# EAGLE design 130812_AriloTX_FINAL (EAGLE 6.4)
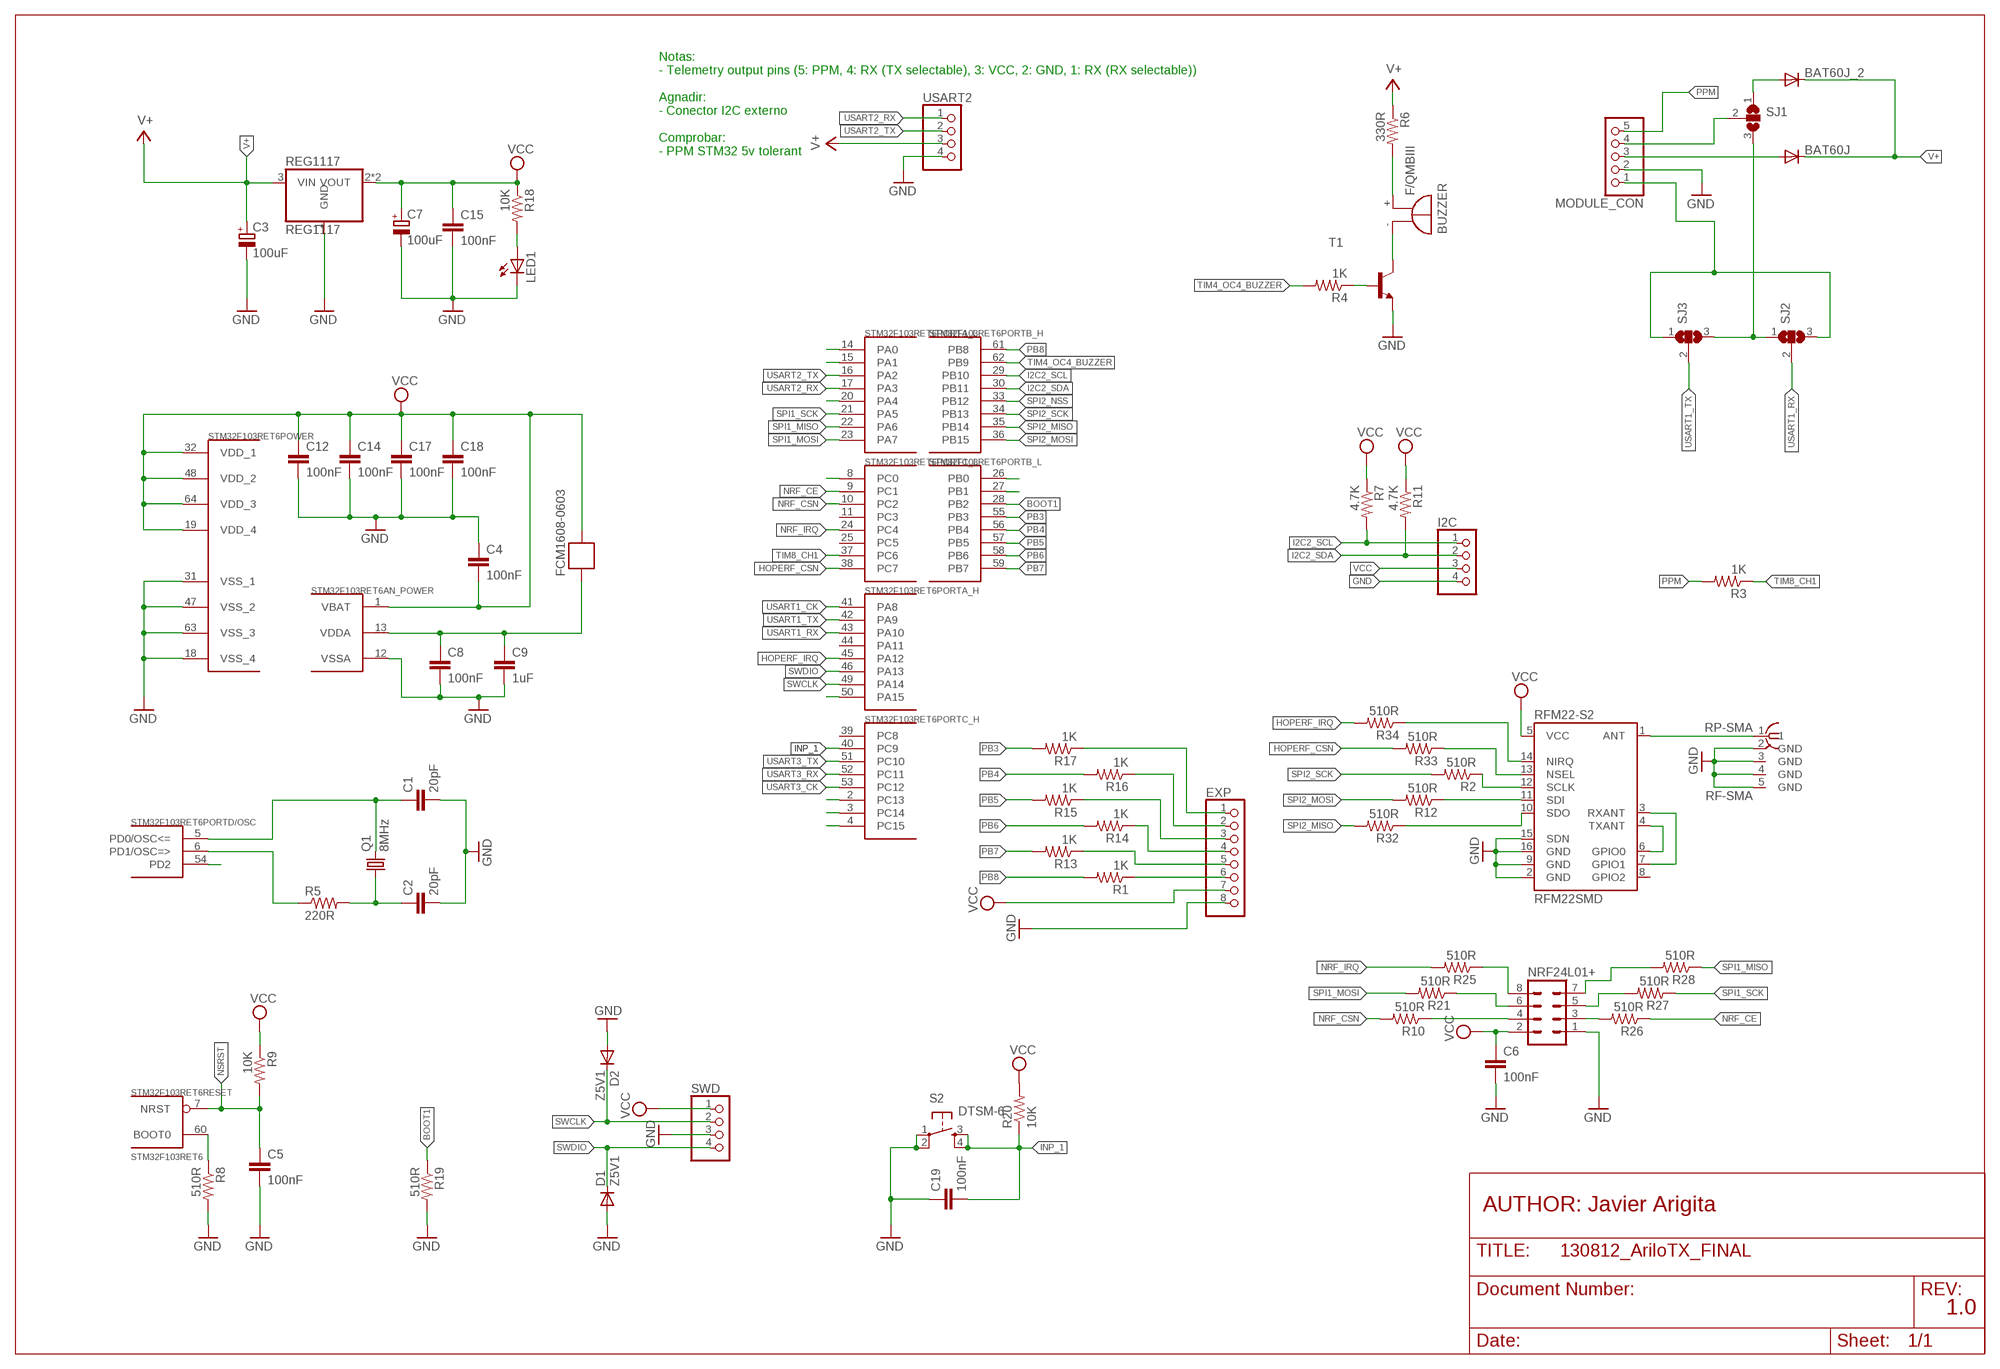
[diagram p0: schematic, sheet 1]

## Parts
BAT60J  DIODE-SOD323-R  [SOD323-R]
BAT60J_2  DIODE-SOD323-R  [SOD323-R]
BUZZER  F/QMBIII  [F/QMBIII]
C1  20pF  C-EUC0805  [C0805]
C2  20pF  C-EUC0805  [C0805]
C3  100uF  CPOL-EUSMCB  [SMC_B]
C4  100nF  C-EUC0805  [C0805]
C5  100nF  C-EUC0805  [C0805]
C6  100nF  C-EUC0805  [C0805]
C7  100uF  CPOL-EUSMCB  [SMC_B]
C8  100nF  C-EUC0805  [C0805]
C9  1uF  C-EUC3216  [C3216]
C12  100nF  C-EUC0805  [C0805]
C14  100nF  C-EUC0805  [C0805]
C15  100nF  C-EUC0805  [C0805]
C17  100nF  C-EUC0805  [C0805]
C18  100nF  C-EUC0805  [C0805]
C19  100nF  C-EUC0805  [C0805]
D1  Z5V1  DIODE-SOD323-R  [SOD323-R]
D2  Z5V1  DIODE-SOD323-R  [SOD323-R]
EXP  PINHD-1X8  [1X08]
FCM1608-0603  FERRITE-BEAD  [R0603]
I2C  PINHD-1X4  [1X04]
LED1  LED0805  [CHIPLED_0805]
MODULE_CON  PINHD-1X5  [1X05]
NRF24L01+  MA04-2  [MA04-2]
Q1  8MHz  CRYSTALSM49  [SM49]
R1  1K  RESISTOR0805  [R0805]
R2  510R  RESISTOR0805  [R0805]
R3  1K  RESISTOR0805  [R0805]
R4  1K  RESISTOR0805  [R0805]
R5  220R  RESISTOR0805  [R0805]
R6  330R  RESISTOR0805  [R0805]
R7  4.7K  RESISTOR0805  [R0805]
R8  510R  RESISTOR0805  [R0805]
R9  10K  RESISTOR0805  [R0805]
R10  510R  RESISTOR0805  [R0805]
R11  4.7K  RESISTOR0805  [R0805]
R12  510R  RESISTOR0805  [R0805]
R13  1K  RESISTOR0805  [R0805]
R14  1K  RESISTOR0805  [R0805]
R15  1K  RESISTOR0805  [R0805]
R16  1K  RESISTOR0805  [R0805]
R17  1K  RESISTOR0805  [R0805]
R18  10K  RESISTOR0805  [R0805]
R19  510R  RESISTOR0805  [R0805]
R20  10K  RESISTOR0805  [R0805]
R21  510R  RESISTOR0805  [R0805]
R25  510R  RESISTOR0805  [R0805]
R26  510R  RESISTOR0805  [R0805]
R27  510R  RESISTOR0805  [R0805]
R28  510R  RESISTOR0805  [R0805]
R32  510R  RESISTOR0805  [R0805]
R33  510R  RESISTOR0805  [R0805]
R34  510R  RESISTOR0805  [R0805]
REG1117  REG1117  [SOT223]
RFM22-S2  RFM22SMD  [RFM22-XXX-S2]
RP-SMA  RF-SMA  [BU-SMA-H]
S2  DTSM-6  [DTSM-6]
SJ1  SJ2W  [SJ_2]
SJ2  SJ2W  [SJ_2]
SJ3  SJ2W  [SJ_2]
STM32F103RET6  STM32F103RET6  STM32F10XRXT6  [TQFP64]
SWD  PINHD-1X4  [1X04]
T1  BC848-NPN-SOT23-BEC  [SOT23-BEC]
USART2  PINHD-1X4  [1X04]

## Nets
BOOT1: R19.1 STM32F103RET6.28(PORTB_L:PB2)
GND: C1.2 C2.2 C3.- C4.1 C5.2 C6.2 C7.- C8.2 C9.2 C12.2 C14.2 C15.2 C17.2 C18.2 C19.1 D1.A D2.A EXP.8 I2C.4 LED1.C MODULE_CON.2 NRF24L01+.1 R8.2 R19.2 REG1117.1(GND) RFM22-S2.2(GND) RFM22-S2.9(GND) RFM22-S2.15(SDN) RFM22-S2.16(GND) RP-SMA.2(GND) RP-SMA.3(GND) RP-SMA.4(GND) RP-SMA.5(GND) S2.1 S2.2 STM32F103RET6.12(AN_POWER:VSSA) STM32F103RET6.18(POWER:VSS_4) STM32F103RET6.31(POWER:VSS_1) STM32F103RET6.47(POWER:VSS_2) STM32F103RET6.63(POWER:VSS_3) SWD.3 T1.E USART2.4
HOPERF_CSN: R33.2 STM32F103RET6.38(PORTC_L:PC7)
HOPERF_IRQ: R34.2 STM32F103RET6.45(PORTA_H:PA12)
I2C2_SCL: I2C.1 R7.2 STM32F103RET6.29(PORTB_H:PB10)
I2C2_SDA: I2C.2 R11.2 STM32F103RET6.30(PORTB_H:PB11)
INP_1: C19.2 R20.1 S2.3 S2.4 STM32F103RET6.40(PORTC_H:PC9)
N$1: C1.1 Q1.2 STM32F103RET6.5(PORTD/OSC:PD0/OSC<=)
N$2: R5.1 STM32F103RET6.6(PORTD/OSC:PD1/OSC=>)
N$3: C2.1 Q1.1 R5.2
N$4: R8.1 STM32F103RET6.60(RESET:BOOT0)
N$5: RFM22-S2.3(RXANT) RFM22-S2.7(GPIO1)
N$6: RFM22-S2.4(TXANT) RFM22-S2.6(GPIO0)
N$7: R2.1 RFM22-S2.12(SCLK)
N$8: R12.1 RFM22-S2.11(SDI)
N$9: MODULE_CON.4 SJ1.2
N$10: LED1.A R18.2
N$11: BAT60J_2.A SJ1.1
N$12: R32.1 RFM22-S2.10(SDO)
N$13: SJ1.3 SJ2.1 SJ3.3
N$14: BAT60J.A MODULE_CON.3
N$15: MODULE_CON.1 SJ2.3 SJ3.1
N$16: BUZZER.+(-) R6.2
N$17: C8.1 C9.1 FCM1608-0603.2 STM32F103RET6.13(AN_POWER:VDDA)
N$18: NRF24L01+.4 R10.1
N$19: NRF24L01+.3 R26.2
N$20: RFM22-S2.1(ANT) RP-SMA.1
N$21: R4.1 T1.B
N$22: R34.1 RFM22-S2.14(NIRQ)
N$23: BUZZER.-(+) T1.C
N$24: R33.1 RFM22-S2.13(NSEL)
N$25: STM32F103RET6.14(PORTA_L:PA0)
N$26: STM32F103RET6.15(PORTA_L:PA1)
N$27: EXP.6 R1.1
N$28: EXP.5 R13.1
N$29: STM32F103RET6.20(PORTA_L:PA4)
N$30: EXP.4 R14.1
N$31: STM32F103RET6.8(PORTC_L:PC0)
N$32: STM32F103RET6.26(PORTB_L:PB0)
N$33: STM32F103RET6.27(PORTB_L:PB1)
N$34: EXP.3 R15.1
N$35: EXP.2 R16.1
N$36: NRF24L01+.5 R27.2
N$37: EXP.1 R17.1
N$38: NRF24L01+.6 R21.1
N$39: NRF24L01+.8 R25.1
N$42: NRF24L01+.7 R28.2
N$43: STM32F103RET6.50(PORTA_H:PA15)
N$44: STM32F103RET6.2(PORTC_H:PC13)
N$45: STM32F103RET6.3(PORTC_H:PC14)
N$46: STM32F103RET6.4(PORTC_H:PC15)
N$47: STM32F103RET6.54(PORTD/OSC:PD2)
NRF_CE: R26.1 STM32F103RET6.9(PORTC_L:PC1)
NRF_CSN: R10.2 STM32F103RET6.10(PORTC_L:PC2)
NRF_IRQ: R25.2 STM32F103RET6.24(PORTC_L:PC4)
NSRST: C5.1 R9.2 STM32F103RET6.7(RESET:NRST)
PB3: R17.2 STM32F103RET6.55(PORTB_L:PB3)
PB4: R16.2 STM32F103RET6.56(PORTB_L:PB4)
PB5: R15.2 STM32F103RET6.57(PORTB_L:PB5)
PB6: R14.2 STM32F103RET6.58(PORTB_L:PB6)
PB7: R13.2 STM32F103RET6.59(PORTB_L:PB7)
PB8: R1.2 STM32F103RET6.61(PORTB_H:PB8)
PPM: MODULE_CON.5 R3.2
SPI1_MISO: R28.1 STM32F103RET6.22(PORTA_L:PA6)
SPI1_MOSI: R21.2 STM32F103RET6.23(PORTA_L:PA7)
SPI1_SCK: R27.1 STM32F103RET6.21(PORTA_L:PA5)
SPI2_MISO: R32.2 STM32F103RET6.35(PORTB_H:PB14)
SPI2_MOSI: R12.2 STM32F103RET6.36(PORTB_H:PB15)
SPI2_NSS: STM32F103RET6.33(PORTB_H:PB12)
SPI2_SCK: R2.2 STM32F103RET6.34(PORTB_H:PB13)
SWCLK: D2.C STM32F103RET6.49(PORTA_H:PA14) SWD.2
SWDIO: D1.C STM32F103RET6.46(PORTA_H:PA13) SWD.4
TIM4_OC4_BUZZER: R4.2 STM32F103RET6.62(PORTB_H:PB9)
TIM8_CH1: R3.1 STM32F103RET6.37(PORTC_L:PC6)
USART1_CK: STM32F103RET6.41(PORTA_H:PA8)
USART1_RX: SJ2.2 STM32F103RET6.43(PORTA_H:PA10)
USART1_TX: SJ3.2 STM32F103RET6.42(PORTA_H:PA9)
USART2_RX: STM32F103RET6.17(PORTA_L:PA3) USART2.1
USART2_TX: STM32F103RET6.16(PORTA_L:PA2) USART2.2
USART3_CK: STM32F103RET6.53(PORTC_H:PC12)
USART3_RX: STM32F103RET6.52(PORTC_H:PC11)
USART3_TX: STM32F103RET6.51(PORTC_H:PC10)
V+: BAT60J.C BAT60J_2.C C3.+ R6.1 REG1117.3(VIN) USART2.3
VCC: C4.2 C6.1 C7.+ C12.1 C14.1 C15.1 C17.1 C18.1 EXP.7 FCM1608-0603.1 I2C.3 NRF24L01+.2 R7.1 R9.1 R11.1 R18.1 R20.2 REG1117.2(VOUT) REG1117.4(VOUT) RFM22-S2.5(VCC) STM32F103RET6.1(AN_POWER:VBAT) STM32F103RET6.19(POWER:VDD_4) STM32F103RET6.32(POWER:VDD_1) STM32F103RET6.48(POWER:VDD_2) STM32F103RET6.64(POWER:VDD_3) SWD.1
Unconnected: RFM22-S2.8(GPIO2) STM32F103RET6.11(PORTC_L:PC3) STM32F103RET6.25(PORTC_L:PC5) STM32F103RET6.39(PORTC_H:PC8) STM32F103RET6.44(PORTA_H:PA11)

## Notes on the sheet
- Notas:
  - Telemetry output pins (5: PPM, 4: RX (TX selectable), 3: VCC, 2: GND, 1: RX (RX selectable))
  
  Agnadir:
  - Conector I2C externo
  
  Comprobar:
  - PPM STM32 5v tolerant
- AUTHOR: Javier Arigita
- 1.0

## Library data of the parts
BAT60J BAT60J_2 D1 D2 = diode:DIODE-: DIODE
BUZZER = buzzer:F/QMBIII: BUZZER Source: Buerklin; OC_FARNELL: unknown; OC_NEWARK: unknown
C1 C2 C4-C6 C8 C12 C14 C15 C17-C19 = rcl:C-EU: CAPACITOR, European symbol
C3 C7 = rcl:CPOL-EU: POLARIZED CAPACITOR, European symbol
C9 = resistor:C-EU: CAPACITOR, European symbol
EXP = pinhead:PINHD-1X8: PIN HEADER
FCM1608-0603 = BaseApp:FERRITE-BEAD
I2C SWD USART2 = pinhead:PINHD-1X4: PIN HEADER
LED1 = CEDT:LED
MODULE_CON = pinhead:PINHD-1X5: PIN HEADER
NRF24L01+ = con-lstb:MA04-2: PIN HEADER; OC_FARNELL: unknown; OC_NEWARK: unknown
Q1 = crystal:CRYSTAL: CRYSTAL; OC_FARNELL: unknown; OC_NEWARK: unknown
R1-R21 R25-R28 R32-R34 = CEDT:RESISTOR
REG1117 = CEDT:REG1117: 800mA and 1A Low Dropout (LDO) Positive Regulator 1.8V, 2.5V, 2.85V, 3.3V, 5V, and Adj
RFM22-S2 = SparkFun-RF:RFM22: The RFM22 is a low-power, low cost radio that is capable of operating in the 434MHz and 900MHz open bands. It's frequency is software defined and there are some very good libraries written for it.
RP-SMA = BaseApp:RF-SMA
S2 = switch-tact:DTSM-6
SJ1-SJ3 = jumper:SJ2W: SMD solder JUMPER
STM32F103RET6 = stm32:STM32F10XRXT6: STM32F101/103 64pin LQFP
T1 = transistor:*-NPN-: NPN Transistror BF959 corrected 2008.03.06

## Board
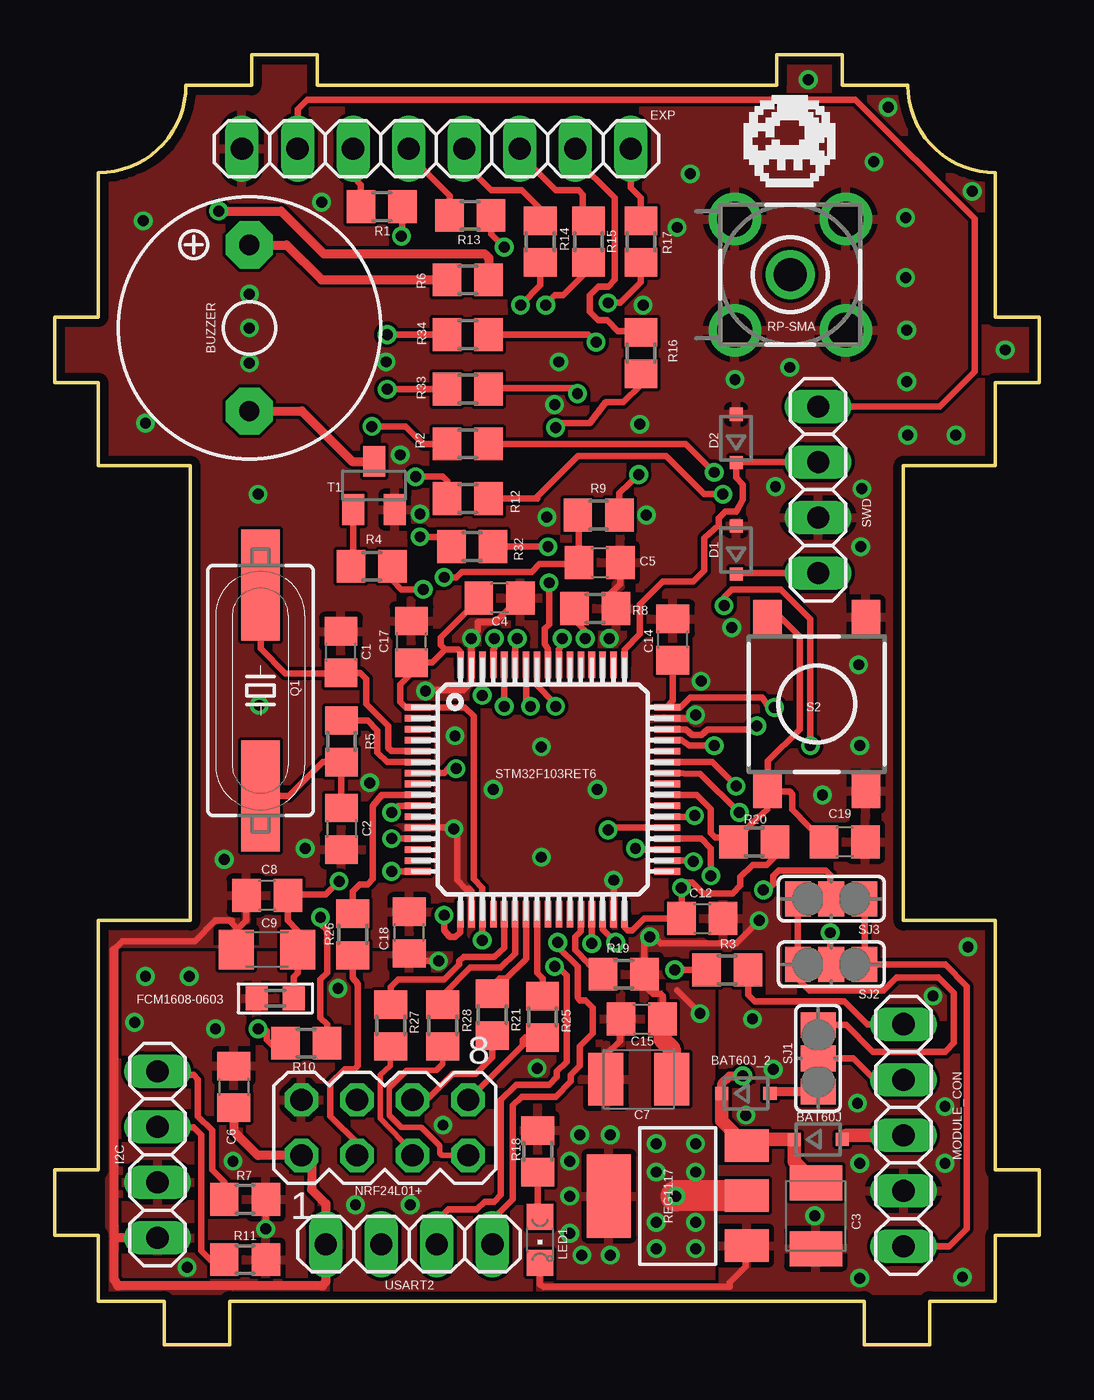
[diagram p1: board, top side]
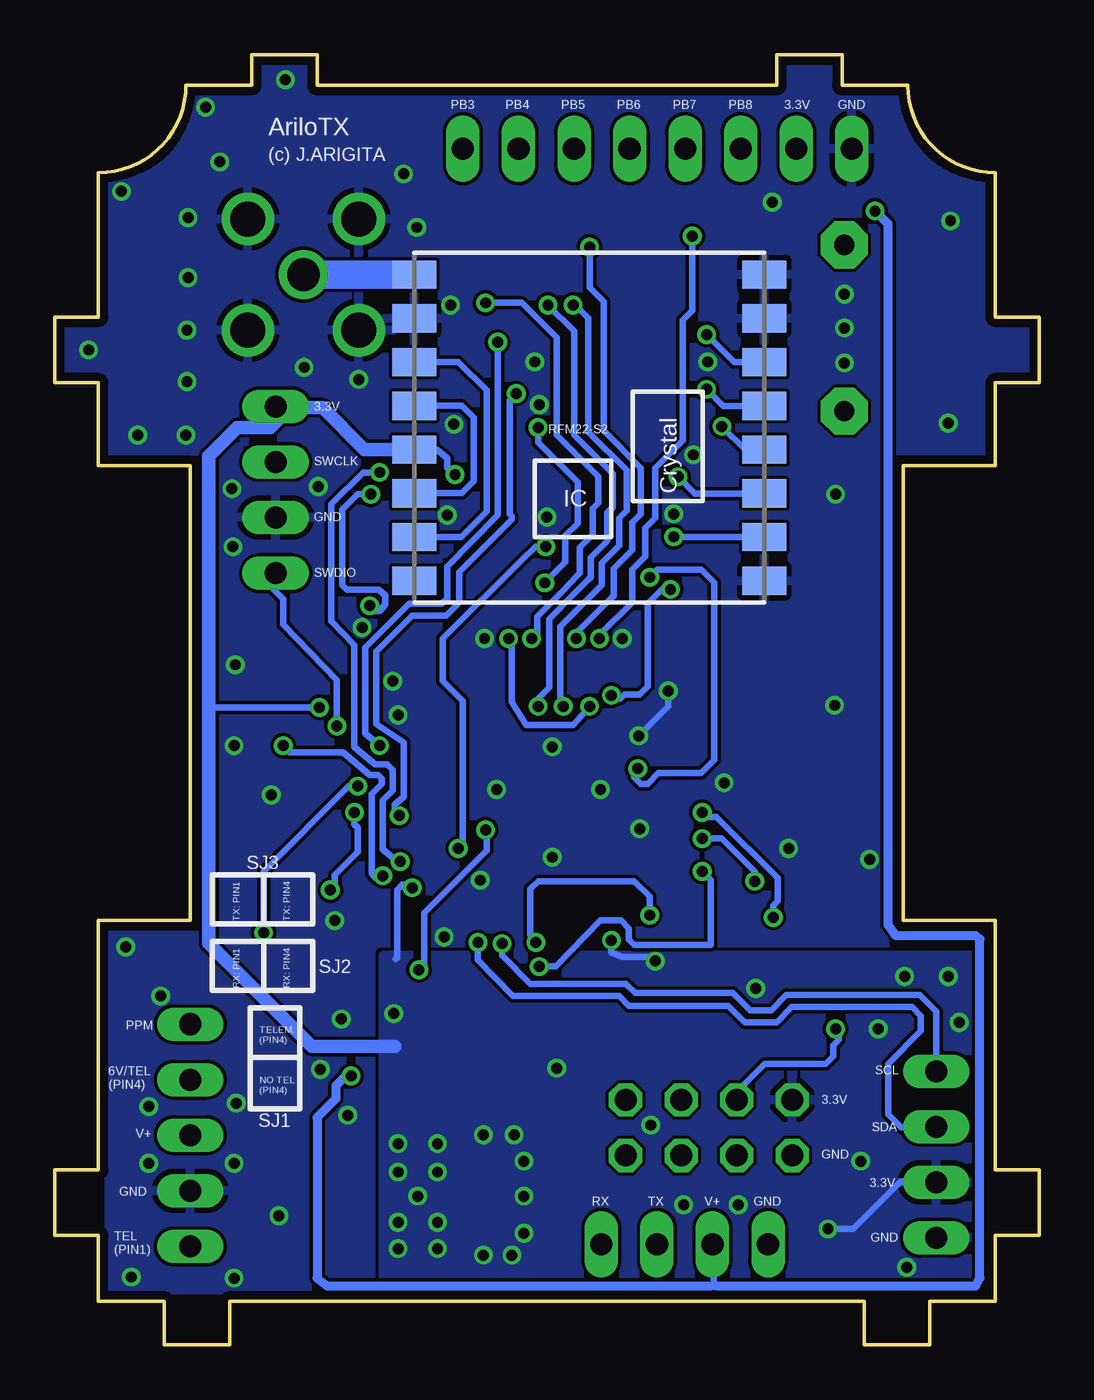
[diagram p2: board, bottom side, seen from below]

Size 45 x 59 mm. Coordinates in mm from the lower left corner, seen from the top.
Outline: 2,2 5,2 5,0 8,0 8,2 37,2 37,0 40,0 40,2 43,2 43,5 45,5 45,8 43,8 43,19.4 38.8,19.4 38.8,40.2 43,40.2 43,44 45,44 45,47 43,47 43,53.6 arc-90 39,57.6 36,57.6 36,59 33,59 33,57.6 12,57.6 12,59 9,59 9,57.6 6,57.6 arc-90 2,53.6 2,47 0,47 0,44 2,44 2,40.2 6.2,40.2 6.2,19.4 2,19.4 2,8 0,8 0,5 2,5 2,2
Copper layers (1*16): Top 0.0356mm / dielectric 1.5011mm / Bottom 0.0356mm
Design rules: minimum track width 6mil, minimum drill 13mil, track to track 6mil, track to pad 6mil, pad to pad 6mil, via to via 6mil, smd to smd 6mil, copper to edge 15mil, drill to drill 6mil, minimum pad ring 7mil, minimum via ring 7mil, stop-mask expansion 4mil, vias tented up to drill 0mil, thermal gap 10mil

### Footprints (pad centres in the part's own frame; a part is rotated, then mirrored left to right if it is on the bottom)
SOD323-R = smd 0.6 x 0.6: A 1.1,0; C -1.1,0
F/QMBIII = drill 0.914 pad 2.159 octagon: + 3.8,0; - -3.8,0
C0805 = smd 1.3 x 1.5: 1 -0.95,0; 2 0.95,0
SMC_B = smd 1.6 x 2.4: + -1.5,0; - 1.5,0
C3216 = smd 1.6 x 1.8: 1 -1.4,0; 2 1.4,0
1X08 = drill 1.016 long: 1 -8.89,0; 2 -6.35,0; 3 -3.81,0; 4 -1.27,0; 5 1.27,0; 6 3.81,0; 7 6.35,0; 8 8.89,0
R0603 = smd 1 x 1.1: 1 -0.85,0; 2 0.85,0
1X04 = drill 1.016 long: 1 -3.81,0; 2 -1.27,0; 3 1.27,0; 4 3.81,0
CHIPLED_0805 = smd 1.2 x 1.2: A 0,-1.05; C 0,1.05
1X05 = drill 1.016 long: 1 -5.08,0; 2 -2.54,0; 3 0,0; 4 2.54,0; 5 5.08,0
MA04-2 = drill 1.016 octagon: 1 -3.81,-1.27; 2 -3.81,1.27; 3 -1.27,-1.27; 4 -1.27,1.27; 5 1.27,-1.27; 6 1.27,1.27; 7 3.81,-1.27; 8 3.81,1.27
SM49 = smd 5.08 x 1.778: 1 -4.826,0; 2 4.826,0
R0805 = smd 1.3 x 1.5: 1 -0.95,0; 2 0.95,0
SOT223 = smd 1.499 x 2.007: 1 -2.261,-3.15; 2 0.025,-3.15; 3 2.311,-3.15 | smd 3.81 x 2.007: 4 0,3.15
RFM22-XXX-S2 = smd 2 x 1.3: 1 -8,7; 2 -8,5; 3 -8,3; 4 -8,1; 5 -8,-1; 6 -8,-3; 7 -8,-5; 8 -8,-7; 9 8,-7; 10 8,-5; 11 8,-3; 12 8,-1; 13 8,1; 14 8,3; 15 8,5; 16 8,7
BU-SMA-H = drill 1.5: 1 0,0 | drill 1.6: 2 -2.54,2.54; 3 2.54,2.54; 4 2.54,-2.54; 5 -2.54,-2.54
DTSM-6 = smd 1.55 x 1.3: 1 -3.975,2.25; 2 3.975,2.25; 3 -3.975,-2.25; 4 3.975,-2.25
SJ_2 = smd 1.168 x 1.6: 1 -1.524,0; 2 0,0; 3 1.524,0
TQFP64 = smd 1.2 x 0.3: 1 -5.7,3.75; 2 -5.7,3.25; 3 -5.7,2.75; 4 -5.7,2.25; 5 -5.7,1.75; 6 -5.7,1.25; 7 -5.7,0.75; 8 -5.7,0.25; 9 -5.7,-0.25; 10 -5.7,-0.75; 11 -5.7,-1.25; 12 -5.7,-1.75; 13 -5.7,-2.25; 14 -5.7,-2.75; 15 -5.7,-3.25; 16 -5.7,-3.75; 33 5.7,-3.75; 34 5.7,-3.25; 35 5.7,-2.75; 36 5.7,-2.25; 37 5.7,-1.75; 38 5.7,-1.25; 39 5.7,-0.75; 40 5.7,-0.25; 41 5.7,0.25; 42 5.7,0.75; 43 5.7,1.25; 44 5.7,1.75; 45 5.7,2.25; 46 5.7,2.75; 47 5.7,3.25; 48 5.7,3.75 | smd 0.3 x 1.2: 17 -3.75,-5.7; 18 -3.25,-5.7; 19 -2.75,-5.7; 20 -2.25,-5.7; 21 -1.75,-5.7; 22 -1.25,-5.7; 23 -0.75,-5.7; 24 -0.25,-5.7; 25 0.25,-5.7; 26 0.75,-5.7; 27 1.25,-5.7; 28 1.75,-5.7; 29 2.25,-5.7; 30 2.75,-5.7; 31 3.25,-5.7; 32 3.75,-5.7; 49 3.75,5.7; 50 3.25,5.7; 51 2.75,5.7; 52 2.25,5.7; 53 1.75,5.7; 54 1.25,5.7; 55 0.75,5.7; 56 0.25,5.7; 57 -0.25,5.7; 58 -0.75,5.7; 59 -1.25,5.7; 60 -1.75,5.7; 61 -2.25,5.7; 62 -2.75,5.7; 63 -3.25,5.7; 64 -3.75,5.7
SOT23-BEC = smd 1 x 1.4: B -0.95,-1.1; C 0,1.1; E 0.95,-1.1

### Placement (x,y rotation side)
BAT60J  34.9,9.4 0 top
BAT60J_2  31.6,11.5 0 top
BUZZER  8.9,46.5 90 top
C1  13.09,31.68 90 top
C2  13.11,23.6 270 top
C3  34.8,5.9 270 top
C4  20.34,34.15 180 top
C5  24.91,35.77 0 top
C6  8.18,11.8 270 top
C7  26.7,12.15 0 top
C8  9.71,20.55 180 top
C9  9.71,18.07 180 top
C12  29.61,19.5 0 top
C14  28.26,32.25 90 top
C15  26.84,14.9 0 top
C17  16.31,32.15 90 top
C18  16.21,18.85 90 top
C19  36.11,23 180 top
D1  31.15,36.34 90 top
D2  31.15,41.45 90 top
EXP  17.45,54.7 180 top
FCM1608-0603  10.09,15.85 0 top
I2C  4.7,8.7 270 top
LED1  22.18,4.8 180 top
MODULE_CON  38.81,9.58 90 top
NRF24L01+  15.09,9.93 0 top
Q1  9.41,29.93 90 top
R1  14.95,52.05 0 top
R2  18.89,41.2 0 top
R3  30.75,17.15 0 top
R4  14.5,35.6 0 top
R5  13.11,27.6 270 top
R6  18.89,48.7 180 top
R7  8.7,6.65 180 top
R8  24.71,33.67 0 top
R9  24.86,37.95 180 top
R10  11.5,13.8 0 top
R11  8.7,3.9 180 top
R12  18.89,38.7 0 top
R13  19,51.65 0 top
R14  22.2,50.45 270 top
R15  24.4,50.45 270 top
R16  26.8,45.35 270 top
R17  26.8,50.45 270 top
R18  22.09,8.85 270 top
R19  26.01,16.95 0 top
R20  31.98,23 0 top
R21  20,15.1 90 top
R25  22.3,15 90 top
R26  13.62,18.76 270 top
R27  15.36,14.6 270 top
R28  17.73,14.6 270 top
R32  19.09,36.5 0 top
R33  18.89,43.7 0 top
R34  18.89,46.2 0 top
REG1117  28.48,6.8 90 top
RFM22-S2  20.57,41.94 0 bottom
RP-SMA  33.63,48.94 180 top
S2  34.84,29.3 270 top
SJ1  34.9,13.1 90 top
SJ2  35.5,17.4 0 top
SJ3  35.5,20.4 180 top
STM32F103RET6  22.3,25.4 0 top
SWD  34.9,39.1 270 top
T1  14.6,39.3 0 top
USART2  16.2,4.6 180 top

### Tracks (layer width: path | path; a pad name or v marks a point on that pad's centre or on a via)
BOOT1
  Top 0.305: R19.1 24.4,17.45 23.8,18.05 23.8,18.65 24.05,18.9 STM32F103RET6.28
GND  (via drill 0.5)
  Top 0.305: C8.2 8.75,20.39 8.75,19.4 8.31,18.96 C9.2 8.31,19.09 8.1,19.3 8.1,19.4 7.35,19.4 6.4,18.45 3.1,18.45 2.7,18.05 | STM32F103RET6.18 19.05,20.75 18.95,20.85 18.8,20.85 18.4,21.25 18.4,23.45 v18.25,23.6 | STM32F103RET6.47 29.15,28.65 v29.3,28.8 | 8.2,10.84 C6.2 | C15.2 27.8,14.96 27.8,15.95 27.7,16.05 27.35,16.05 26.96,16.44 R19.2 26.96,18.39 27.3,18.65 27.4,18.65 27.7,18.35 31.15,18.35 v32.2,19.4 | LED1.C 22.18,2.77 22.35,2.65 30.85,2.65 30.85,2.85 31.6,3.6 31.6,4.5 REG1117.1 | STM32F103RET6.31 25.55,21.2 | v19.05,32.3 STM32F103RET6.63 19.05,30.3 18.7,29.95 17.15,29.95 v16.95,29.9 | R8.2 25.31,34.26 25.85,34.8 25.85,35.8 25.86,35.79 C5.2 | C4.1 21.04,33.94 20.15,33.05 19.35,33.05 19.35,32.65 19.05,32.35 | STM32F103RET6.12 18.25,23.65 | 2.7,4.98 2.79,4.89
  Top 0.406: I2C.4 2.79,4.89 2.7,4.75 2.7,3.05 2.9,2.7 12.25,2.7 12.4,2.9 12.4,4.55 | 8.2,10.84 8.2,9.75 9.29,8.66 NRF24L01+.1 11.34,8.66 11.75,8.25 11.75,7.1 12.4,6.45 12.4,4.55 | USART2.4 12.4,4.55 | 2.7,18.05 2.7,4.98
  Top 0.813: C15.2 27.79,13.96 28.2,13.55 C7.-
  Bottom 0.305: v29.3,28.8 29.35,28.8 | v19.05,32.3 19,32.3 | v16.95,29.9 16.95,29.2 v18.3,27.85
  other vias: 43.45,45.5 34.45,57.85 38.1,56.6 41.95,52.75 11.45,22.7 14.4,25.7 22.25,22.3 27.2,18.65 25.55,21.25 30.95,32.8 29.55,30.35 25.35,32.3 31.9,14.9 36.7,11.05 36.8,8.3 36.8,3.05 41.5,3.1 40.15,15.95 32.85,12.6 24.8,25.4 20.05,25.4 22.25,27.35 40.7,10.9 40.7,8.3 41.75,18.2 35.1,25.15 7.75,22.2 9.35,29.25 9.3,38.9 4.05,51.4 4.15,42.15 8.9,46.5 12.2,52.25 15.15,44.95 15.8,40.7 16.7,38 23.05,44.95 22.5,37.85 22.85,43 26.75,42.1 27.05,37.95 31.1,44.15 26.9,47.55 28.45,51.1 38.9,51.55 38.9,48.8 38.95,46.4 37.45,54.1 38.95,44.05 33.6,44.7 41.2,41.6 39,41.6 29.05,53.55 8.9,48.05 8.9,44.9 32.95,39.25 36.9,39.15 36.85,36.5 36.75,31.1 36.8,27.4 34.75,5.9 31.6,10.5
  pour Top (rank 2): 42.5,18.9 38.3,19 38.3,40.7 42.5,40.7 42.5,44.5 44.5,44.5 44.5,46.5 42.5,46.5 42.5,53.1 arc-90 38.5,57.1 35.5,57.1 35.5,58.5 33.5,58.5 33.5,57.1 11.5,57.1 11.5,58.5 9.5,58.5 9.5,57.1 6.5,57.1 arc-90 2.5,53.1 2.5,46.5 0.5,46.5 0.5,44.5 2.5,44.5 2.5,40.7 6.7,40.7 6.7,18.9 2.5,18.9 2.5,2.5 42.5,2.5
  pour Bottom (rank 2): 42.5,18.9 38.3,19 38.3,40.7 42.5,40.7 42.5,44.5 44.5,44.5 44.5,46.5 42.5,46.5 42.5,53.1 arc-90 38.5,57.1 35.5,57.1 35.5,58.5 33.5,58.5 33.5,57.1 11.5,57.1 11.5,58.5 9.5,58.5 9.5,57.1 6.5,57.1 arc-90 2.5,53.1 2.5,46.5 0.5,46.5 0.5,44.5 2.5,44.5 2.5,40.7 6.7,40.7 6.7,18.9 2.5,18.9 2.5,2.5 42.5,2.5
HOPERF_CSN  (via drill 0.5)
  Top 0.305: R33.2 19.85,43.75 23.7,43.75 v23.9,43.5 | v29.25,24.2 29.2,24.15 STM32F103RET6.38
  Bottom 0.305: v23.9,43.5 24.2,43.2 24.2,38 24.1,37.9 24.1,37.75 26.5,35.35 26.5,33.95 27.1,33.35 28.65,33.35 30.3,31.7 30.3,28.4 29.05,27.55 29.05,25.05 29.45,24.7 29.45,24.4 v29.25,24.2
HOPERF_IRQ  (via drill 0.5)
  Top 0.305: R34.2 24.4,46.2 v24.75,45.85 | v30.15,27.4 29,27.4 | 28.95,27.45 29,27.4 | 29,27.4 28.65,27.65 STM32F103RET6.45
  Bottom 0.305: v24.75,45.85 24.75,37.95 27.05,35.6 27.05,34.1 27.3,33.9 28.8,33.9 30.8,31.9 30.8,27.95 v30.15,27.4
I2C2_SCL  (via drill 0.5)
  Top 0.305: R7.2 7.75,7.45 7.2,8 7.2,9.8 6.55,10.45 6.55,12.15 6.35,12.35 4.79,12.35 I2C.1 | STM32F103RET6.29 v24.55,18.35
  Bottom 0.305: v24.55,18.35 24.55,17.8 23.25,16.5 18.9,16.5 18.45,16.1 14,16.1 13.2,15.3 12.25,15.3 11.55,16 5.45,16 4.7,15.25 I2C.1
I2C2_SDA  (via drill 0.5)
  Top 0.305: R11.2 7.1,3.9 6.7,4.3 6.7,9.6 6.35,9.95 4.72,9.95 I2C.2 | STM32F103RET6.30 25.05,19 v25.65,18.4
  Bottom 0.305: v25.65,18.4 25.65,17.6 24.05,15.95 19.2,15.95 18.75,15.5 14.2,15.5 13.45,14.75 12,14.75 11.3,15.45 5.8,15.45 5.4,15.05 5.4,14.35 6.9,12.85 6.9,10.55 6.3,9.95 4.72,9.95 I2C.2
INP_1
  Top 0.305: S2.4 32.59,25.23 | C19.2 33.73,24.48 33.73,25.18 33.6,25.3 32.65,25.3 | STM32F103RET6.40 29.35,25.15 30,24.5 30,23.4 30.2,23.2 30.85,23.2 R20.1 31.98,23.95 32.59,24.48 32.59,25.23 | S2.3 33.17,33.27 34.05,32.4 34.05,28.15 32.6,26.7 32.6,25.4 32.55,25.35 32.6,25.35 32.65,25.3 | 32.59,25.23 32.65,25.3
N$1
  Top 0.305: Q1.2 9.41,31.84 10.55,30.7 13.06,30.7 C1.1 13.97,30.73 14.25,30.45 14.25,29.3 15.25,28.3 15.25,27.3 15.4,27.15 STM32F103RET6.5 16.7,27.15
N$2
  Top 0.305: R5.1 14.3,28.55 14.75,28.1 14.75,27.1 15.2,26.65 STM32F103RET6.6
N$3
  Top 0.305: Q1.1 10.7,25.1 12.25,26.65 R5.2 C2.1
N$4  (via drill 0.5)
  Top 0.305: v20.55,29.2 STM32F103RET6.60 | v24.25,32.3 24.25,32.65 23.9,33 23.9,33.55 | 23.9,33.55 23.9,33.6 23.75,33.75 | 23.75,33.75 23.75,33.7 | 23.75,33.7 23.8,33.75 23.75,33.75 | 23.75,33.75 23.7,33.7 23.75,33.7 | R8.1 23.77,33.67 23.9,33.55
  Bottom 0.305: v20.55,29.2 21.3,28.35 23.45,28.35 24.1,29.4 24.1,32.15 v24.25,32.3
N$5
  Bottom 0.305: RFM22-S2.7 26.41,36.94 25.25,38.1 25.25,43.65 26.55,44.95 28.55,44.95 RFM22-S2.3
N$6
  Bottom 0.305: RFM22-S2.6 28.51,38.94 28.5,38.95 26.4,38.95 25.85,39.5 25.85,42.4 26.4,42.95 28.55,42.95 RFM22-S2.4
N$7  (via drill 0.5)
  Top 0.305: v14.5,42 16.05,42 16.85,41.2 R2.1 | R2.1 17.94,41.22 17.9,41.25 18.05,41.25 18.1,41.2 R2.1
  Bottom 0.305: RFM22-S2.12 13.44,40.94 v14.5,42
N$8  (via drill 0.5)
  Top 0.305: v16.5,39.7 17.75,39.7 17.95,39.5 17.95,38.72 R12.1
  Bottom 0.305: RFM22-S2.11 15.74,38.94 v16.5,39.7
N$9
  Top 0.305: MODULE_CON.4 37.48,12.12 36.5,13.1 SJ1.2
N$10
  Top 0.305: R18.2 22.09,6.01 22.2,5.9 | 22.2,5.9 22.25,5.85 22.2,5.85 | 22.2,5.9 22.2,5.85 | 22.2,5.85 LED1.A | LED1.A 22.15,5.85 22.1,5.8 22.1,5.85 | 22.1,5.85 22.2,5.95 22.15,5.95 22.1,5.9 | 22.2,5.9 22.1,5.9 | 22.1,5.9 22.1,5.85 | 22.1,5.85 LED1.A
N$11
  Top 0.406: SJ1.1 32.78,11.58 BAT60J_2.A
N$12  (via drill 0.5)
  Top 0.305: v16.7,36.95 17.55,36.95 17.9,36.6 17.9,36.13 R32.1
  Bottom 0.305: RFM22-S2.10 v16.69,36.94 v16.7,36.95
N$13
  Top 0.305: SJ3.3 SJ2.1 34,17.48 34,16.7 34.5,16.2 37.9,16.2 38.5,16.8 40.4,16.8 41.1,16.1 41.1,13.8 40.7,13.4 37.4,13.4 36.18,14.62 SJ1.3
N$14
  Top 0.61: MODULE_CON.3 36.18,9.58 BAT60J.A
N$15
  Top 0.305: MODULE_CON.1 40.9,4.5 41.7,5.3 41.7,16.4 40.7,17.4 SJ2.3 SJ3.1
N$16
  Top 0.305: R6.2 17.9,48.7
  Top 0.406: BUZZER.+ 10.6,50.3 12.2,48.7 17.9,48.7
N$17  (via drill 0.5)
  Top 0.305: FCM1608-0603.2 10.94,16.84 11.1,17 C9.1 11.11,18.94 10.65,19.4 10.65,20.39 C8.1 10.71,20.6 12.4,20.6 v13,21.2 | v15.4,23.15 STM32F103RET6.13
  Bottom 0.305: v15.4,23.15 14.5,23.15 13,21.65 v13,21.2
N$18  (via drill 0.5)
  Top 0.305: v9.3,14.45 9.6,14.45 9.7,14.35 9.7,13.95 9.9,13.75 10.2,13.75 | 10.2,13.75 10.6,13.75 10.6,13.8 10.55,13.85 | R10.1 10.25,13.8 10.2,13.75
  Bottom 0.305: NRF24L01+.4 13.82,11.58 12.55,12.85 9.75,12.85 9.4,13.2 9.4,13.7 9.15,13.95 9.15,14.3 v9.3,14.45
N$19
  Top 0.305: NRF24L01+.3 13.82,9.23 12.6,10.45 12.6,11.95 13.25,12.6 13.7,12.6 13.85,12.75 13.85,16.5 13.65,16.75 13.62,16.77 R26.2
N$20
  Bottom 0.305: 33.6,48.95 33.59,48.94 RP-SMA.1
  Bottom 1.3: RFM22-S2.1 33.59,48.94
N$21
  Top 0.305: T1.B 13.65,35.7 R4.1
N$22  (via drill 0.5)
  Top 0.305: v15.2,46.2 R34.1
  Bottom 0.305: RFM22-S2.14 13.94,44.94 v15.2,46.2
N$23
  Top 0.406: BUZZER.- 11.3,42.7 13.6,40.4 T1.C
N$24  (via drill 0.5)
  Top 0.305: v15.2,43.7 R33.1
  Bottom 0.305: RFM22-S2.13 14.44,42.94 v15.2,43.7
N$27
  Top 0.305: EXP.6 13.64,53.41 14,53.05 R1.1
N$28
  Top 0.305: EXP.5 16.18,54.42 18.05,52.55 R13.1
N$30
  Top 0.305: EXP.4 18.72,54.03 19.95,52.8 21.35,52.8 22.2,51.95 R14.1
N$34
  Top 0.305: EXP.3 21.26,54.44 22.9,52.8 23.95,52.8 24.15,52.6 24.15,51.65
  Top 0.406: 24.15,51.65 R15.1
N$35
  Top 0.305: EXP.2 23.8,54.25 25.6,52.45 25.6,48.7 25.3,48.4 24.85,48.4 24.45,48 24.45,47.25 24.85,46.85 25.25,46.85 25.75,46.35 26.8,46.35 | 26.8,46.35 26.85,46.3 | R16.1 26.8,46.35
N$36
  Top 0.254: NRF24L01+.5 16.36,8.81 14.88,10.35 14.88,12.35 15.35,12.75 R27.2
N$37
  Top 0.305: EXP.1 26.34,52.91 26.8,52.45 R17.1
N$38
  Top 0.305: NRF24L01+.6 17,11.2 18.2,12.4 19.25,12.4 20,13.15 R21.1
N$39
  Top 0.305: NRF24L01+.8 21.4,13.7 21.4,13.95 21.5,14.05 R25.1 22.35,14.05
N$42
  Top 0.254: NRF24L01+.7 17.69,8.66 17.6,8.75 17.6,9.1 16.75,9.95 15.85,9.95 15.3,10.5 15.3,11.75 16.1,12.55 17.45,12.55 17.75,12.85 17.75,13.63
  Top 0.305: 17.75,13.63 R28.2
NRF_CE
  Top 0.305: R26.1 13.62,20.73 13.95,21.05 14.3,21.05 14.55,21.3 14.55,24.65 14.95,25.15 STM32F103RET6.9
NRF_CSN  (via drill 0.5)
  Top 0.305: R10.2 12.45,14.65 12.15,14.95 12.15,16.7 12.45,17 12.45,18.95 12.15,19.25 v12.15,19.55 | v15.4,24.35 15.7,24.65 STM32F103RET6.10 16.65,24.65
  Bottom 0.305: v12.15,19.55 12.15,20.1 11.95,20.3 11.95,21.35 14.75,24.15 15.2,24.15 v15.4,24.35
NRF_IRQ
  Top 0.305: R25.2 22.3,16.75 22.05,17 STM32F103RET6.24 22.05,19.75
NSRST  (via drill 0.5)
  Top 0.305: R9.2 23.96,37.89 C5.1 23.95,35.78 23.95,35.8 23.9,35.8 23.8,35.7 22.15,35.7 21.8,35.35 18.6,35.35 18.35,35.1 v17.8,35.1 | 23.9,38 R9.2 | 23.9,37.9 R9.2 | v18.35,26.35 18,26.35 17.8,26.15 STM32F103RET6.7 16.55,26.15 | R9.2
  Bottom 0.305: v18.35,26.35 18.5,26.2 18.5,25.95 18.2,25.65 17.9,25.65 17.4,26.15 15.45,26.15 14.85,26.75 14.85,34.85 15.45,35.45 17.45,35.45 v17.8,35.1
PB3  (via drill 0.5)
  Top 0.305: R17.2 26.8,48.6 25.85,47.65 v25.3,47.65 | v23.2,32.3 23.2,32.05 23.05,31.8 STM32F103RET6.55 23.05,31.05
  Bottom 0.305: v25.3,47.65 23.65,47.65 22.05,46.05 22.05,41.6 20.15,39.7 20.15,38.5 20.4,38.25 20.4,37.05 21,36.45 21,35.3 21.1,35.2 21.8,34.45 22.95,33.3 22.95,32.5 v23.2,32.3
PB4  (via drill 0.5)
  Top 0.305: R16.2 26.8,43.9 26,43.1 25.2,43.1 24.45,42.15 23.1,42.15 v22.9,41.95 | v22.6,34.85 22.6,32.95 22.4,32.75 22.4,32.05 22.55,31.85 STM32F103RET6.56
  Bottom 0.305: v22.9,41.95 22.9,41.25 21.1,39.45 21.1,37.55 21.65,37 21.65,35.8 v22.6,34.85
PB5  (via drill 0.5)
  Top 0.305: R15.2 24.4,49.15 23.25,48 22.85,48 v22.45,47.55 | v22.9,29.2 22.9,29.1 22.8,29 22.8,29.4 22.05,30.15 STM32F103RET6.57
  Bottom 0.305: v22.45,47.55 21.25,46.35 21.25,41.6 19.5,39.85 19.5,38.3 19.65,38.15 19.75,38.05 19.75,36.75 20.5,36 20.5,35.1 20.6,35 21.25,34.35 22.4,33.2 22.4,30.05 22.9,29.55 v22.9,29.2
PB6  (via drill 0.5)
  Top 0.305: R14.2 22.2,48.45 v21.3,47.55 | v21.75,29.2 21.55,29.3 STM32F103RET6.58
  Bottom 0.305: v21.3,47.55 21.2,47.55 20.6,46.95 20.6,41.75 18.85,40 18.85,38.15 19.2,37.8 19.2,36.55 20,35.75 20,34.75 21.9,32.85 21.9,29.35 v21.75,29.2
PB7  (via drill 0.5)
  Top 0.305: R13.2 19.95,50.8 v20.55,50.2 | v21.15,32.3 21.05,32.15 STM32F103RET6.59
  Bottom 0.305: v20.55,50.2 20.55,48.35 19.9,47.7 19.9,41.8 18.2,40.1 18.2,38 18.6,37.6 18.6,36.35 19.45,35.5 19.45,34.25 19.55,34.15 19.9,33.8 21.15,32.55 v21.15,32.3
PB8  (via drill 0.5)
  Top 0.305: R1.2 15.9,50.85 v15.85,50.7 | v20.1,32.3 20.1,31.85 20.05,31.8 STM32F103RET6.61
  Bottom 0.305: v15.85,50.7 15.85,47.3 16.3,46.85 16.3,41.35 17.55,40.1 17.55,37.8 18,37.35 18,36.05 18.6,35.45 18.6,33.95 20.05,32.5 v20.1,32.3
PPM
  Top 0.305: MODULE_CON.5 37.14,14.66 36.1,15.7 32,15.7 31.7,16 R3.2
SPI1_MISO
  Top 0.305: R28.1 17.73,15.98 19,17.25 20.4,17.25 21.05,17.9 STM32F103RET6.22
SPI1_MOSI
  Top 0.305: R21.2 20,16.4 20.35,16.75 20.65,16.75 21.55,17.65 STM32F103RET6.23 21.55,19.75
SPI1_SCK
  Top 0.305: R27.1 15.36,16.36 15.7,16.7 17.8,16.7 18.5,17.4 18.5,17.55 18.7,17.75 20.1,17.75 20.55,18.15 STM32F103RET6.21
SPI2_MISO  (via drill 0.5)
  Top 0.305: R32.2 v22.55,36.5 | v26.55,22.7 26.6,22.65 STM32F103RET6.35
  Bottom 0.305: v22.55,36.5 23,36.5 23.65,35.9 27.25,32.3 27.25,30.35 26.35,29.45 26.35,22.9 v26.55,22.7
SPI2_MOSI  (via drill 0.5)
  Top 0.305: R12.2 22.05,38.7 22.05,38.8 23.9,40.65 27.95,40.65 29.7,38.9 v30.55,38.9 | v30.6,33.8 30.6,34.2 30.95,34.55 33.2,34.55 34.55,33.2 v34.55,27.4 | STM32F103RET6.36 29.55,23.15 30,22.7 v30,21.45
  Bottom 0.305: v30.55,38.9 31.15,38.9 31.85,38.2 31.85,34.75 31.65,34.55 30.2,34.55 29.9,34.3 29.9,33.85 30.15,33.55 30.4,33.55 v30.6,33.8 | v30,21.45 30.1,21.35 30.35,21.35 30.4,21.4 30.5,21.55 30.5,25.2 30.05,25.65 30.05,25.9 30.2,26.05 30.6,26.05 31.8,27.1 34.25,27.1 v34.55,27.4
SPI2_SCK  (via drill 0.5)
  Top 0.305: R2.2 28.85,41.2 v30.15,39.9 | v29.2,22.1 28.95,22.1 28.9,22.15 STM32F103RET6.34
  Bottom 0.305: v30.15,39.9 30.9,39.9 32.35,38.45 32.35,33.1 31.3,32 31.3,27.35 30.35,26.55 29.8,26.55 29.55,26.3 29.55,25.35 30,24.9 30,22.65 29.5,22.25 29.35,22.1 v29.2,22.1
SWCLK
  Top 0.305: SWD.2 31.17,40.37 D2.C | STM32F103RET6.49 26.05,31.8 26.75,32.5 26.75,33.85 27.8,34.9 29.2,34.9 29.7,35.4 29.7,36.9 30.35,37.5 30.35,37.8 30.65,38.1 31.15,38.1 31.45,38.65 31.45,39.35 31.15,39.65 D2.C | D2.C
SWDIO  (via drill 0.5)
  Top 0.305: SWD.4 31.2,35.29 D1.C | STM32F103RET6.46 28.85,28.15 29.15,27.9 29.55,27.9 29.85,28.15 31.95,28.15 v32.1,28.3
  Bottom 0.305: v32.1,28.3 32.1,30.4 34.55,32.95 34.55,34.1 35.15,34.7 35.15,35.04 SWD.4
TIM4_OC4_BUZZER  (via drill 0.5)
  Top 0.305: R4.2 15.45,34.95 15.85,34.55 v16.85,34.55 | v19.55,29.7 STM32F103RET6.62
  Bottom 0.305: v16.85,34.55 17.25,34.55 17.9,33.9 17.9,30.1 18.25,29.75 18.95,29.75 19.15,29.55 19.4,29.55 v19.55,29.7
TIM8_CH1  (via drill 0.5)
  Top 0.305: R3.1 v28.35,17.15 | v25.3,23.55 25.4,23.65 STM32F103RET6.37
  Bottom 0.305: v28.35,17.15 28.1,17.4 28.1,19.75 25.25,22.6 25.25,23.5 v25.3,23.55
USART1_RX  (via drill 0.5)
  Top 0.305: STM32F103RET6.43 30.05,26.65 v31.15,25.55 | v35.45,18.85 35.45,17.45 SJ2.2
  Bottom 0.305: v31.15,25.55 31.55,25.55 35.45,21.65 v35.45,18.85
USART1_TX  (via drill 0.5)
  Top 0.305: STM32F103RET6.42 29.5,26.1 v31.3,24.35 | v32.4,20.8 32.6,20.8 32.85,21.05 32.85,21.45 33.1,21.7 35.25,21.7 35.45,21.5 35.45,20.45 SJ3.2
  Bottom 0.305: v31.3,24.35 31.3,23.8 31.15,23.65 31.15,22.55 32.2,21.5 32.2,21 v32.4,20.8
USART2_RX  (via drill 0.5)
  Top 0.305: USART2.1 20.01,5.71 20.95,6.65 20.95,10.95 21.35,11.35 22.9,11.35 23.6,12.05 23.6,12.35 24,12.75 24,13.65 24.6,14.25 24.6,15.4 24.25,15.75 24,15.75 23.9,15.9 23.9,17.3 23,18.2 v23,18.4 | 18.55,19.6 STM32F103RET6.17 18.55,18.85 18.3,18.65 18.05,18.65 17.8,18.95 v17.8,19.65
  Bottom 0.305: v23,18.4 23.25,18.75 23.25,20.85 22.9,21.2 18.5,21.2 17.8,20.5 v17.8,19.65
USART2_TX  (via drill 0.5)
  Top 0.305: USART2.2 17.47,5.67 18,6.2 19.3,6.2 19.65,6.55 20.1,6.55 20.4,6.85 20.4,11.2 21.1,11.9 22.6,11.9 22.95,12.25 22.95,12.5 23.4,12.95 23.4,16.9 23,17.3 v22.85,17.3 | v15.4,21.65 STM32F103RET6.16
  Bottom 0.305: v22.85,17.3 22.1,17.3 20.05,19.4 19.1,19.4 18.75,19.05 18.75,18.55 18.5,18.3 15,18.3 15,21.25 v15.4,21.65
V+  (via drill 0.5)
  Top 0.406: BAT60J_2.C 30.5,11.95 30.85,12.3 v31.45,12.3 | v7.5,51.85 10.35,51.85 12.3,49.9 19.65,49.9 19.85,49.7 19.85,48.75 19.84,48.73 | 19.84,48.73 19.8,48.7 | R6.1 19.84,48.73
  Top 0.61: C3.+ 33.8,8.4 BAT60J.C 31.92,9.4 REG1117.3 30.5,10.25 BAT60J_2.C
  Bottom 0.305: 14.88,4.32 14.88,2.77 | 14.88,2.77 15,2.7 | 14.88,2.77 14.82,2.77 14.75,2.7
  Bottom 0.406: v31.45,12.3 31.7,12.3 32.15,11.85 32.15,11.25 33,10.4 33,3.05 32.55,2.7 15,2.7 | 14.75,2.7 2.9,2.7 2.7,3.05 2.7,18.55 2.9,18.7 6.55,18.7 6.9,19.2 6.9,51.25 v7.5,51.85 | USART2.3 14.88,4.32
VCC  (via drill 0.5)
  Top 0.305: 17.85,31.8 17.25,31.2 C17.1 16.31,30.71 15.8,30.2 15.8,29.4 16.05,29.15 STM32F103RET6.1 18.75,29.15 19.15,28.75 19.15,21.3 19.55,20.9 STM32F103RET6.19 v19.55,18.5 | 17.85,31.8 18.45,31.8 18.55,31.7 STM32F103RET6.64 | C4.2 18.9,33.6 17.65,32.35 17.65,32 17.85,31.8 | SWD.1 40.46,42.91 42.05,44.5 42.05,51.5 36.6,56.95 11.55,56.95 11.1,56.5 EXP.7 | v32.9,29.15 32.65,29.15 32.35,29.6 29.05,29.6 28.6,29.15 STM32F103RET6.48 28.26,29.46 C14.1 | v26.7,39.8 25.8,38.95 25.8,38.15 R9.1 | v17.55,17.55 16.6,17.55 16.55,17.6 16.46,17.65 C18.1 | STM32F103RET6.32 26.05,19.1 26.2,18.95 26.4,18.95 26.95,19.5 C12.1 28.66,20.79 v28.65,20.9 28.65,20.95 28.85,21.15 29.15,21.15 29.65,20.65 31,20.65 31.35,21 31.35,21.4 31.9,21.95 32.55,21.95 32.94,22.34 R20.2 | 28.45,16.2 v29.5,15.15 | R7.1 v9.65,5.3 | C7.+ 25.2,13.25 25.85,13.9 25.85,14.8 | 25.85,14.85 25.85,14.9 25.9,14.95 C15.1 | C15.1 25.9,14.85 25.8,14.85 | 25.75,14.85 25.8,14.85 | 25.8,14.85 25.85,14.8 | 25.85,14.8 25.85,14.85 | 25.85,14.85 C15.1
  Top 1.422: REG1117.2 28.43,6.83 v28.4,6.8
  Bottom 0.305: RFM22-S2.5 27.54,40.94 27.05,40.55 27.05,40.1 v26.7,39.8 | v32.9,29.15 37.85,29.15 37.95,29.25 | v19.55,18.5 19.55,17.95 19.05,17.75 17.85,17.75 v17.55,17.55 | v9.65,5.3 8.5,5.3 6.35,7.45 4.72,7.45 I2C.3 | v28.65,20.9 28.85,21.05 29.1,21.05 29.35,20.8 29.35,17.7 29.4,17.65
  Bottom 0.61: 29.45,13.65 33.25,13.65 37.95,18.35 37.95,29.25 37.95,40.65 36.65,41.95 35.15,41.95 34.6,42.5 SWD.1 34.54,42.85 32.75,42.85 30.84,40.94 RFM22-S2.5
  other vias: 25.4,9.6 23.55,8.4 23.55,6.8 23.55,5.1 25.4,4.1 29.3,4.4 29.3,5.6 29.3,7.9 29.3,9.2 16.25,6.4 12.95,16.3 6.15,16.85 22.05,12.65 17.75,10.05 6.05,3.55 24,9.6 24.1,4.1 27.5,4.4 27.5,5.6 27.5,7.9 27.5,9.2 4.15,16.85 7.35,14.45 13.75,6.4 8.15,8.4 3.65,14.75
  pour Bottom: 30,2.4 2.4,2.4 2.4,17.8 30,17.8
  pour Bottom: 30,2.4 3.2,2.4 3.2,17.8 30,17.8
  pour Top: 30,2.4 3.2,2.4 3.2,17.8 30,17.8

### Text on the board
bPlace: GND | 3.3V | PB8 | PB7 | PB6 | PB5 | PB4 | PB3 | AriloTX | (c) J.ARIGITA | 3.3V | SWCLK | GND | SWDIO | SJ3 | TX: PIN4 | TX: PIN1 | SJ2 | RX: PIN4 | RX: PIN1 | TELEM. / (PIN4) | PPM | SCL | NO TEL / (PIN4) | 6V/TEL / (PIN4) | 3.3V | SDA | SJ1 | V+ | GND | 3.3V | GND | GND | V+ | TX | RX | GND | TEL / (PIN1)